# EasyEDA Pro project EDU_A3_PCB_1_v1.epro

# Schematic Schematic4
Board Name: Board4; Create Date: 2026-01-27; Page Name: P1; Project Name: RSA1分线板; Schematic Name: Schematic4; Update Date: 2026-01-27; Company: 嘉立创EDA; Page Size: A4; Version: V1.0
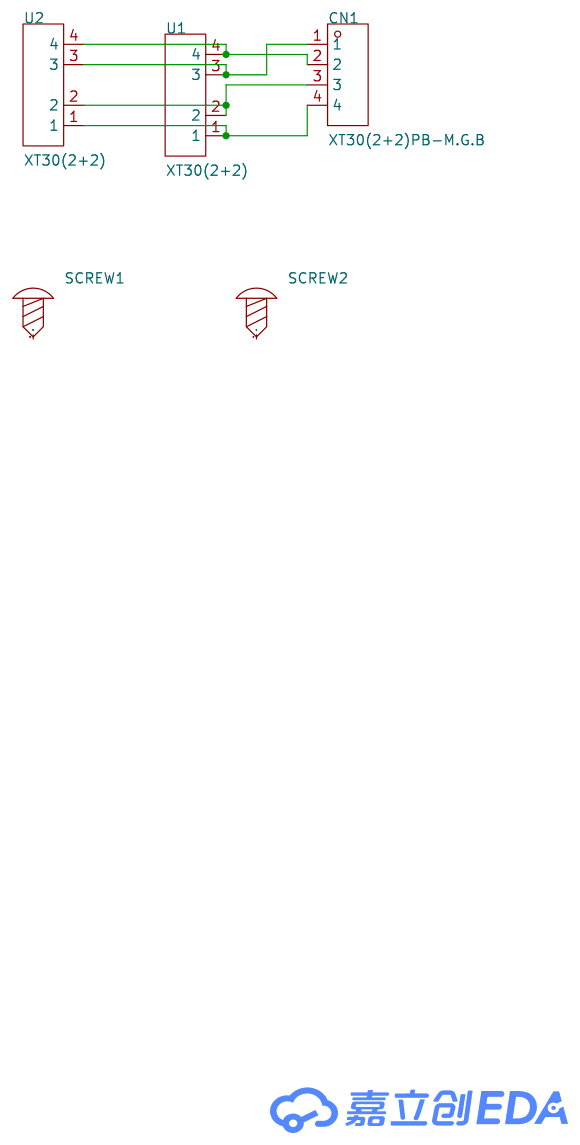
[diagram p0: schematic sheet]

## Parts
CN1  XT30(2+2)PB-M.G.B  [CONN-TH_XT30PB-M]
SCREW1  -  [M3螺丝]
SCREW2  -  [M3螺丝]
U1  XT30(2+2)  [CONN-TH_XT30-2-2]
U2  XT30(2+2)  [CONN-TH_XT30-2-2]

## Library data of the parts
CN1 = XT30(2+2)PB-M.G.B: LCSC Part Name: XT30PB(2+2)功率数据混合插头公金黑PCB直插; Supplier Part: C19268029; Manufacturer: AMASS(艾迈斯); JLCPCB Part Class: 扩展库; Datasheet: https://item.szlcsc.com/datasheet/XT30(2%252B2)PB-M.G.B/20526040.html; Supplier: LCSC
SCREW1 SCREW2 = M3螺丝: Supplier Footprint: 插件
U1 U2 = XT30(2+2): Supplier Part: C9900178769; Supplier Footprint: 插件; Supplier: LCSC

## Nets
$1N287: CN1.2 U1.4 U2.4
$1N292: CN1.1 U1.3 U2.3
$1N340: CN1.3 U1.2 U2.2
$1N346: CN1.4 U1.1 U2.1

Not connected (* = marked no-connect by the designer): SCREW1 1; SCREW2 1

# Board PCB9
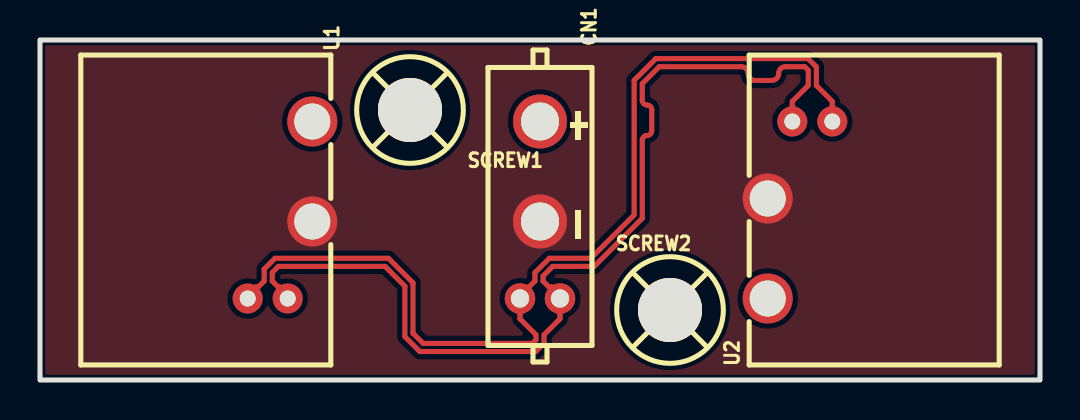
[diagram p1: board, top side]
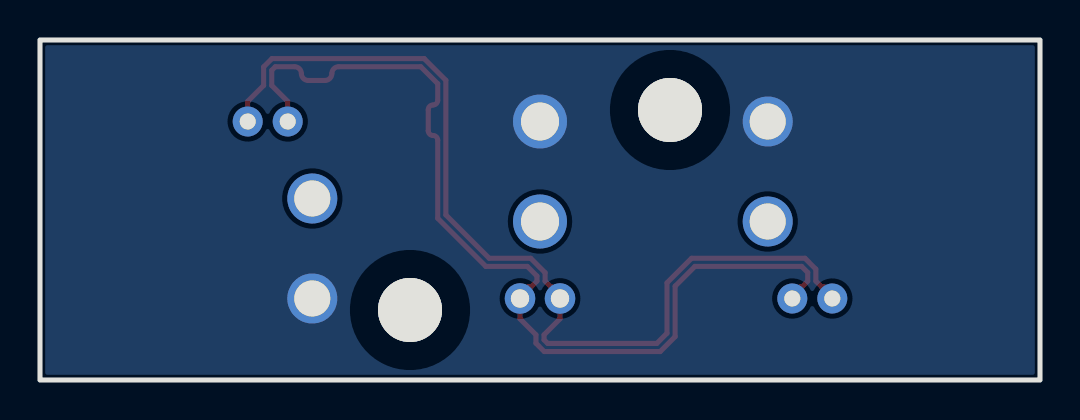
[diagram p2: board, bottom side, seen from below]

Outline 50 x 17 mm; copper layers: Top Layer, Bottom Layer. Coordinates in mm from the lower left corner of the outline.
Outline path: rectangle 0,17 50,0
Stack: Top Layer 0.035mm / Dielectric1 1.51mm FR4 er 4.5 / Bottom Layer 0.035mm

## Design rules (mm)
net $1N292: DP1
net $1N287: DP1
template: 自定义配置
spacing copperThickness1oz (default): track to track 0.102, other pairs 0.152 to 0.3
spacing copperThickness2oz: track to track 0.203, other pairs 0.152 to 0.3
track width copperThickness1oz (default): min 0.127, default 0.254, max 2.54
track width copperThickness2oz: min 0.203, default 0.254, max 2.54
differential pair differentialPair (default): width min 0.127, default 0.254, max 2.54; gap min 0.152, default 0.152
via viaSize (default): diameter min 0.5, default 0.61, max 10; hole min 0.3, default 0.305, max 6.3

## Placement (name value [footprint] x y rotation side)
CN1  XT30(2+2)PB-M.G.B  [CONN-TH_XT30PB-M]  25 8.5 270 top
SCREW1  -  [M3螺丝]  18.5 13.5 180 top
SCREW2  -  [M3螺丝]  31.5 3.5 0 top
U1  XT30(2+2)  [CONN-TH_XT30-2-2]  12 8.5 270 top
U2  XT30(2+2)  [CONN-TH_XT30-2-2]  38 8.5 90 top

## Footprints (pads in the part's own frame, mm; a bottom-side part is the same pattern mirrored in y, then rotated)
CONN-TH_XT30-2-2
  round 2.5 hole 1.8: 1(-4.425,1.615) 2(0.575,1.615)
  round 1.5 hole 0.8: 3(4.425,0.385) 4(4.425,-1.615)
CONN-TH_XT30PB-M
  round 1.524 hole 0.914: 1(4.425,1) 2(4.425,-1)
  round 2.7 hole 1.9: 3(0.575,0) 4(-4.425,0)
M3螺丝
  round 3.2 hole 3.2: 1(0,0)

## Nets
As in the schematic.

Pads without a net: SCREW1 1; SCREW2 1

## Routing (per net, layer and track width the routed paths; a pad name or vN(x,y) marks a point on that pad's centre or on a via; arc(x,y) is an arc through that point)
$1N287: length 48.7
  Top Layer w0.254: U2.4 39.62,13.93 38.82,14.73 38.82,15.65 38.4,16.07 30.79,16.07 29.71,14.98 29.71,8.25 27.54,6.09 25.47,6.09 24.75,5.37 24.75,4.94 24.46,4.66 24.42,4.66 24,4.24 CN1.2 24,3.06 24.8,2.26 24.8,2.01 24.62,1.83 19.16,1.83 18.65,2.34 18.65,4.86 17.42,6.09 11.75,6.09 11.21,5.54 11.21,4.94 10.92,4.66 10.8,4.66 10.38,4.24 U1.4
$1N292: length 48.7
  Top Layer w0.254: U2.3 37.62,13.93 38.41,14.73 38.41,15.48 38.23,15.66 37.28,15.66 arc(37.03,15.56) 36.93,15.32 arc(36.83,15.08) 36.59,14.98 35.75,14.98 arc(35.51,15.08) 35.41,15.32 arc(35.31,15.56) 35.06,15.66 30.96,15.66 30.11,14.82 30.11,13.99 arc(30.18,13.82) 30.35,13.75 arc(30.52,13.68) 30.59,13.51 30.59,12.46 arc(30.52,12.3) 30.35,12.23 arc(30.18,12.16) 30.11,11.99 30.11,8.09 27.71,5.68 25.63,5.68 25.15,5.2 25.15,4.94 25.44,4.66 25.58,4.66 26,4.24 CN1.1 26,3.06 25.2,2.26 25.2,1.84 24.79,1.42 18.99,1.42 18.24,2.17 18.24,4.69 17.25,5.68 11.92,5.68 11.61,5.38 11.61,4.94 11.9,4.66 11.97,4.66 12.38,4.24 U1.3

## Copper pours and planes (outline as drawn; the poured copper is in the pictures)
$1N340 on Top Layer: -2.31,19.3 63.23,19.3 63.23,-1.91 -2.31,-1.91
$1N346 on Bottom Layer: -1.42,33.27 50.91,33.27 50.91,-2.3 -1.42,-2.3

Small or netless copper shapes (teardrops, artwork), in the pictures only: 4 on Top Layer
